# Altium project AltiumSTM32_ExamplePCB.PrjPcb
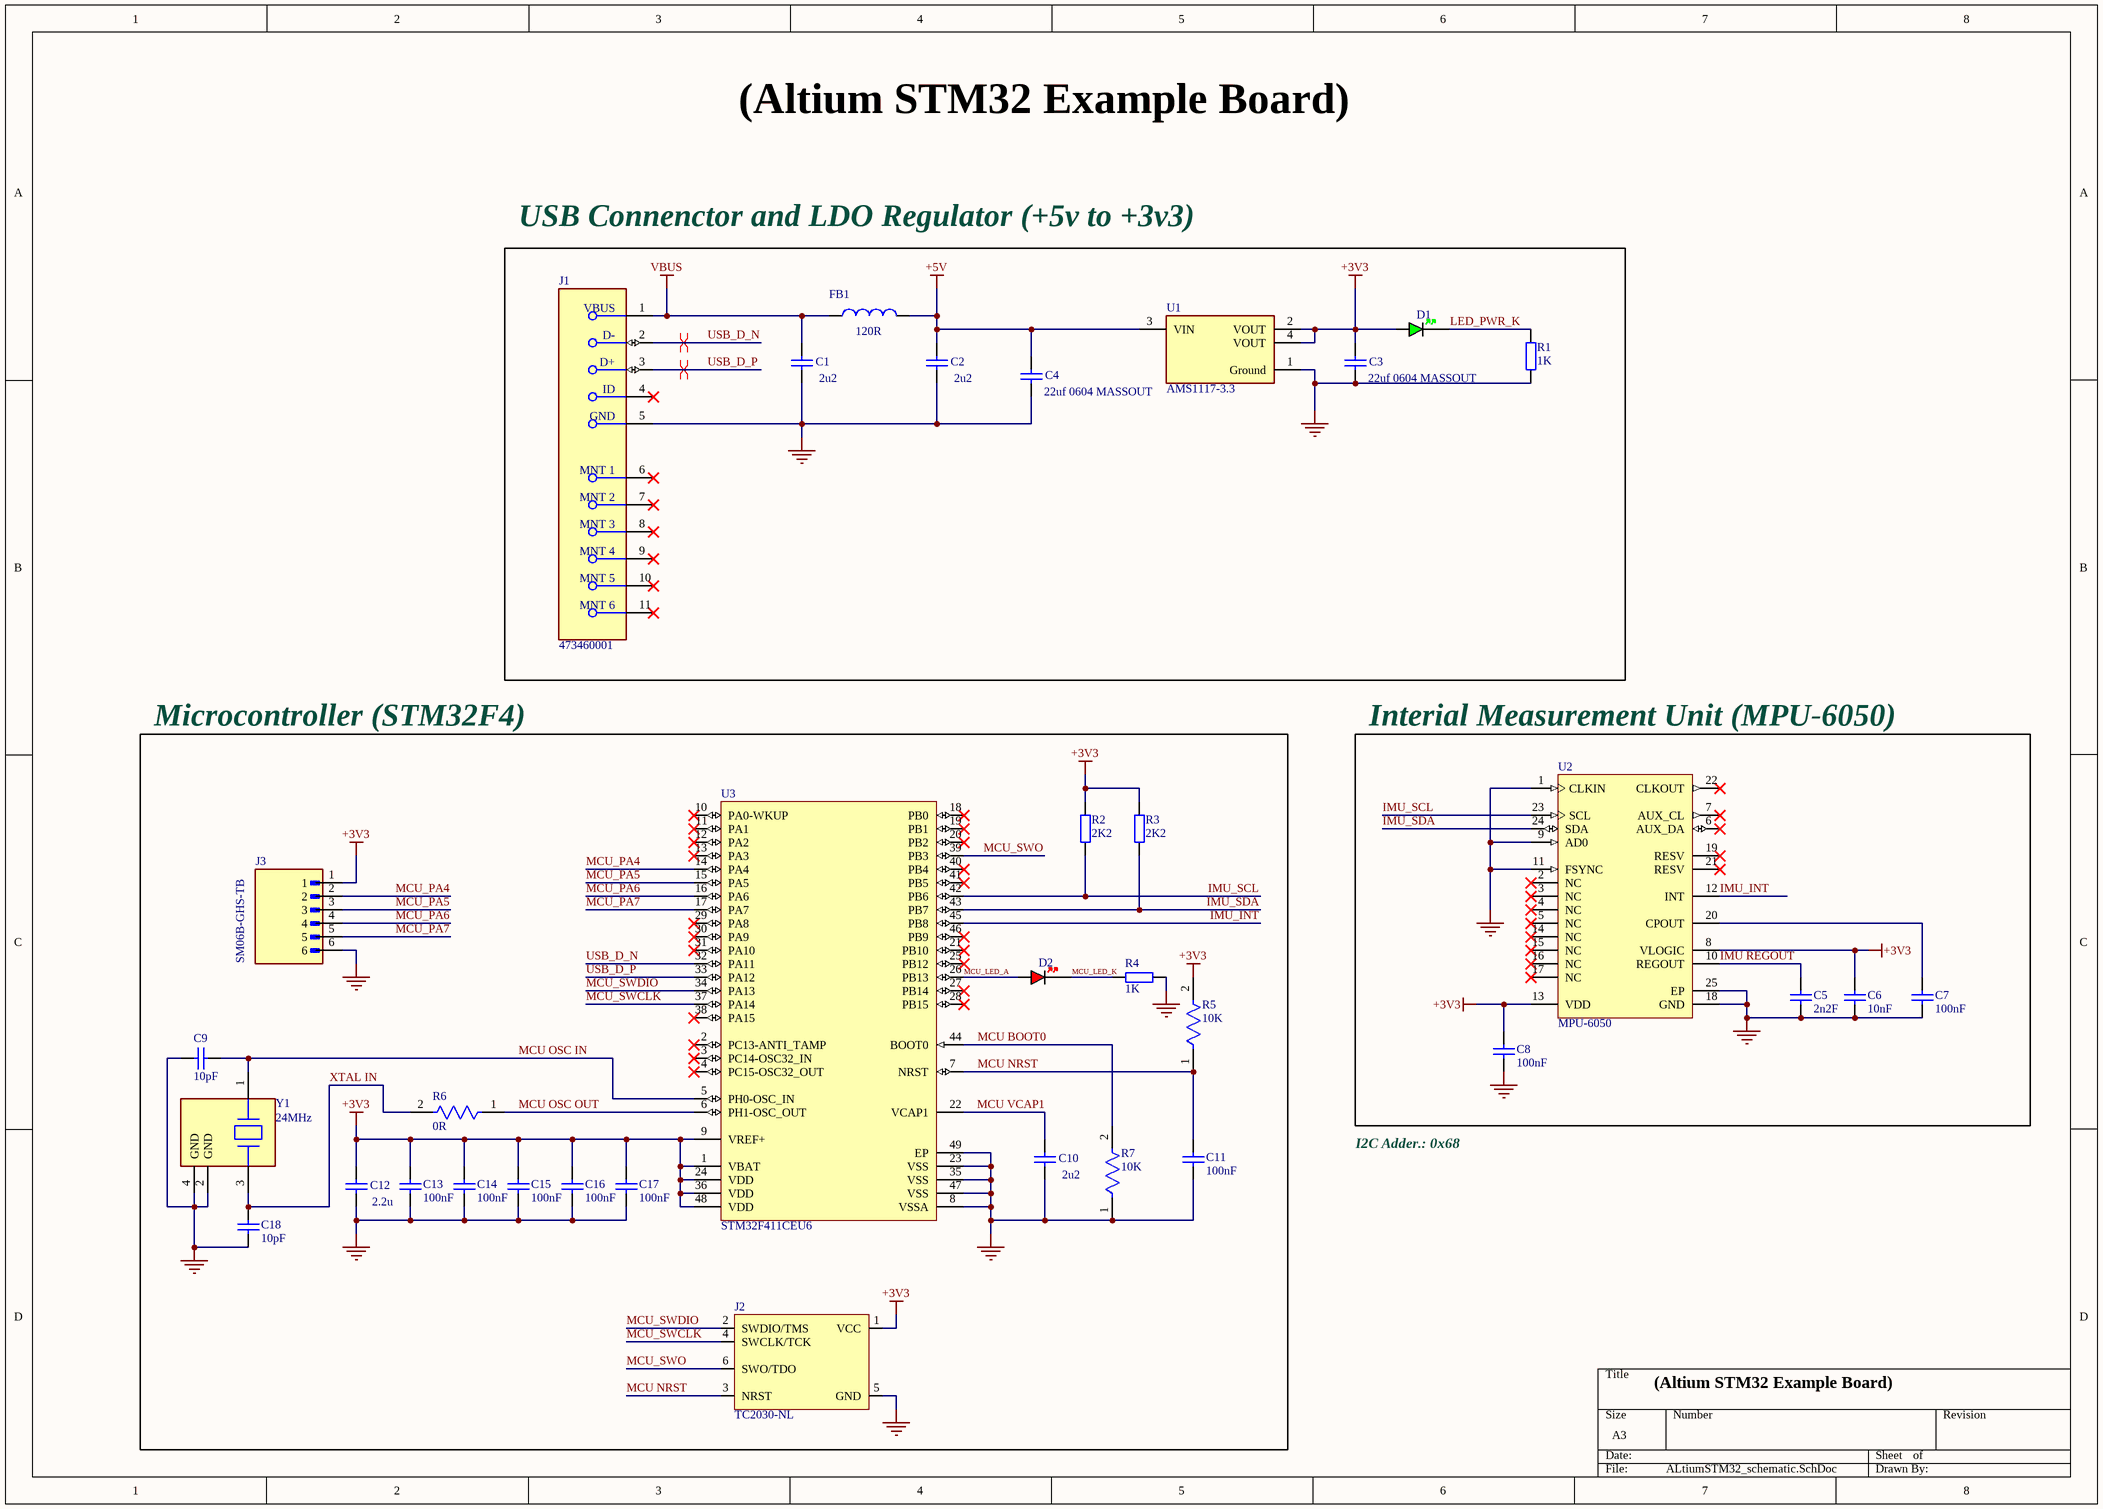
[diagram p0: ALtiumSTM32_schematic.SchDoc]
1 sheet, 35 parts. Net scope: global (net labels, ports and power ports of the same name join across sheets).
Board file: PCB1.PcbDoc

## Sheet ALtiumSTM32_schematic.SchDoc
size A3; SheetNumber: 1; SheetTotal: 1

### Parts
C1  2u2  [WCAP-CSGP_0603_L1.6W0.8H0.8_Reflow]
C2  2u2  [WCAP-CSGP_0603_L1.6W0.8H0.8_Reflow]
C3  22uf 0604 MASSOUT  [WCAP-CSGP_0603_L1.6W0.8H0.8_Reflow]
C4  22uf 0604 MASSOUT  [WCAP-CSGP_0603_L1.6W0.8H0.8_Reflow]
C5  2n2F  [CAPC1005X56X25LL10T15]
C6  10nF  [CAPC1005X56X25LL10T15]
C7  100nF  [CAPC1005X56X25LL10T15]
C8  100nF  [CAPC1005X56X25LL10T15]
C9  10pF  [CAPC1005X56X25LL10T15]
C10  2u2  [WCAP-CSGP_0603_L1.6W0.8H0.8_Reflow]
C11  100nF  [CAPC1005X56X25LL10T15]
C12  2.2u  [WCAP-CSGP_0603_L1.6W0.8H0.8_Reflow]
C13  100nF  [CAPC1005X56X25LL10T15]
C14  100nF  [CAPC1005X56X25LL10T15]
C15  100nF  [CAPC1005X56X25LL10T15]
C16  100nF  [CAPC1005X56X25LL10T15]
C17  100nF  [CAPC1005X56X25LL10T15]
C18  10pF  [CAPC1005X56X25LL10T15]
D1  GREEN  [LED_0402_GREEN]  (value not drawn)
D2  RED  [LED_0402_RED]  (value not drawn)
FB1  120R  [WE-CBF HF_0603_HC]
J1  473460001  [FP-473460001-MFG]
J2  TC2030-NL  [TC2030-NL-FP]  (no BOM)
J3  SM06B-GHS-TB  [JST_SM06B-GHS-TB]
R1  1K  [RES_0402]
R2  2K2  [RES_0402]
R3  2K2  [RES_0402]
R4  1K  [RES_0402]
R5  10K  [FP-AC0402-MFG]
R6  0R  [FP-AC0402-MFG]
R7  10K  [FP-AC0402-MFG]
U1  AMS1117-3.3  [FP-AMS1117-IPC_C]
U2  MPU-6050  [IS-QFN-24_V]
U3  STM32F411CEU6  [STM-UFQFPN48_L]
Y1  24MHz  [FP-ABM10AIG-MFG]

### Blocks framed on the sheet
USB Connenctor and LDO Regulator (+5v to +3v3): C1-C4 D1 FB1 J1 R1 U1
Interial Measurement Unit (MPU-6050): C5-C8 U2

### Nets
+3V3: C3.1 C6.2 C8.2 C12.1 C13.2 C14.2 C15.2 C16.2 C17.2 D1.A J2.1(VCC) J3.1 R2.2 R3.2 R5.2 U1.2(VOUT) U1.4(VOUT) U2.8(VLOGIC) U2.13(VDD) U3.1(VBAT) U3.9(VREF+) U3.24(VDD) U3.36(VDD) U3.48(VDD)
+5V: C2.1 C4.1 FB1.2 U1.3(VIN)
GND: C1.2 C2.2 C3.2 C4.2 C5.1 C6.1 C7.1 C8.1 C9.2 C10.2 C11.1 C12.2 C13.1 C14.1 C15.1 C16.1 C17.1 C18.1 J1.5(GND) J2.5(GND) J3.6 R1.1 R4.1 R7.1 U1.1(Ground) U2.1(CLKIN) U2.9(AD0) U2.11(FSYNC) U2.18(GND) U2.25(EP) U3.8(VSSA) U3.23(VSS) U3.35(VSS) U3.47(VSS) U3.49(EP) Y1.2(GND) Y1.4(GND)
VBUS: C1.1 FB1.1 J1.1(VBUS)
IMU REGOUT: C5.2 U2.10(REGOUT)
IMU_INT: U2.12(INT) U3.45(PB8)
IMU_SCL: R2.1 U2.23(SCL) U3.42(PB6)
IMU_SDA: R3.1 U2.24(SDA) U3.43(PB7)
LED_PWR_K: D1.K R1.2
MCU BOOT0: R7.2 U3.44(BOOT0)
MCU NRST: C11.2 J2.3(NRST) R5.1 U3.7(NRST)
MCU OSC IN: C9.1 U3.5(PH0-OSC_IN) Y1.1(1_Crystal)
MCU OSC OUT: R6.1 U3.6(PH1-OSC_OUT)
MCU VCAP1: C10.1 U3.22(VCAP1)
MCU_LED_A: D2.A U3.26(PB13)
MCU_LED_K: D2.K R4.2
MCU_PA4: J3.2 U3.14(PA4)
MCU_PA5: J3.3 U3.15(PA5)
MCU_PA6: J3.4 U3.16(PA6)
MCU_PA7: J3.5 U3.17(PA7)
MCU_SWCLK: J2.4(SWCLK/TCK) U3.37(PA14)
MCU_SWDIO: J2.2(SWDIO/TMS) U3.34(PA13)
MCU_SWO: J2.6(SWO/TDO) U3.39(PB3)
USB_D_N: J1.2(D-) U3.32(PA11)
USB_D_P: J1.3(D+) U3.33(PA12)
XTAL IN: C18.2 R6.2 Y1.3(2_Crystal)
NetC7_2: C7.2 U2.20(CPOUT)

Not connected (* = marked no-connect by the designer): J1 4(ID)* 6(MNT_1)* 7(MNT_2)* 8(MNT_3)* 9(MNT_4)* 10(MNT_5)* 11(MNT_6)*; U2 2(NC)* 3(NC)* 4(NC)* 5(NC)* 6(AUX_DA)* 7(AUX_CL)* 14(NC)* 15(NC)* 16(NC)* 17(NC)* 19(RESV)* 21(RESV)* 22(CLKOUT)*; U3 2(PC13-ANTI_TAMP)* 3(PC14-OSC32_IN)* 4(PC15-OSC32_OUT)* 10(PA0-WKUP)* 11(PA1)* 12(PA2)* 13(PA3)* 18(PB0)* 19(PB1)* 20(PB2)* 21(PB10)* 25(PB12)* 27(PB14)* 28(PB15)* 29(PA8)* 30(PA9)* 31(PA10)* 38(PA15)* 40(PB4)* 41(PB5)* 46(PB9)*

### Layout directives
differential pair; net class diff_usb: USB_D_N, USB_D_P

### Notes on the sheet
- (Altium STM32 Example Board)
- Microcontroller (STM32F4)
- I2C Adder.: 0x68

### Library data of the parts
C1-C4 C10 C12 = CMP-03913-53914739-2: WCAP-CSGP 0603 (1608Metric) Ceramic Capacitor 0.063Lx0.031W 1.60mmx0.80mm X7R ±10% 220pF; Insulation Resistance: 10GΩ; Voltage Rating: 16V; Length: 1.6mm; Dielectric: X7R; Height: 800µm; Case/Package: 0603; Mount: Surface Mount; Packaging: Tape & Reel (TR); RoHS: Compliant; Case Code (Metric): 1608; Tolerance: 10%; Case Code (Imperial): 0603; Capacitance: 220pF; Min Operating Temperature: -55°C; Thickness: 863.6µm; Voltage Rating (DC): 16V; Width: 800µm; Max Operating Temperature: 125°C
C5-C9 C11 C13-C18 = CMP-2008-02845-1: Part Number: 0402YD223KAT2A; Manufacturer: AVX Interconnect / Elco
D1 = LED_0402_GREEN: LED 0402 GREEN SMD
D2 = LED_0402_RED: LED 0402 RED SMD
FB1 = CMP-0220-00101-3: Ferrite Bead (emi Suppression), 1.6X0.8X0.8MM (0603), 600O Impedance At 100 Mhz; Current Rating: 400mA; DC Resistance (DCR): 220mΩ; Max Current Rating: 500mA; Impedance: 600Ω; Tolerance: 25%; Resistance: 350mΩ; Number of Lines: 1; Test Frequency: 100MHz; Height: 800µm; Min Operating Temperature: -55°C; Length: 1.6mm; Width: 800µm; Case Code (Imperial): 0603; Depth: 800µm; Number of Pins: 2; Case Code (Metric): 1608; Case/Package: SMD/SMT; Lead Free: Lead Free; Core Material: Ferrite; Max Operating Temperature: 125°C; Termination: SMD/SMT; RoHS: Compliant; REACH SVHC: Unknown; Max DC Current: 500mA; Mount: Surface Mount
J1 = CMP-2000-05246-2: CONN RCPT USB2.0 MICRO B SMD R/A; Manufacturer: Molex; Conn Orientation: Right Angle; Is Female: yes; Shielding: true; Pitch: 0.65mm; Number Of Contacts: 5; Voltage Rating: 30V; Current Rating: 1.8A; Device Class L2: USB Connectors; Digikey Description: CONN RCPT USB2.0 MICRO B SMD R/A; Height: 2.945mm; RoHS: TRUE; ComponentLink2Description: Datasheet; Octopart: https://octopart.com/47346-0001-molex-7164928; Automotive: No; Package: 0; Category: Conn; Device Class L1: Connectors; Usb Standard: USB 2.0; Temperature: -30°C to +85°C; Temperature Range Low: -30°C; Footprint Url: https://www.molex.com/pdm_docs/sd/473460001_sd.pdf; ComponentLink2URL: https://www.molex.com/webdocs/datasheets/pdf/en-us/0473460001_IO_CONNECTORS.pdf; Lead Free: Yes; Manufacturer Part Number: 473460001; Contact Material: Gold,Nickel; Temperature Range High: +85°C; Device Class L3: unset
J2 = TC2030-NL: Tag-Connect No-Solder SWD Debug Connector (No Legs) DO NOT PLACE; Manufacturer: Tag-Connect; Manufacturer Part Number: TC2030-NL-FP
J3 = CMP-002-00176-1: Connector Header Surface Mount, Right Angle 6 position 0.049 (1.25mm); MF: JST Sales; Source: SM06B-GHS-TB.SchLib; Component Type: Standard; MP: SM06B-GHS-TB; Check_prices: https://www.snapeda.com/parts/SM06B-GHS-TB/JST/view-part/?ref=eda; SnapEDA_Link: https://www.snapeda.com/parts/SM06B-GHS-TB/JST/view-part/?ref=snap; Pins: 6; Design Item ID: SM06B-GHS-TB; Case/Package: None; Value: *
R1-R4 = RES_0402: Resistor SMD 0402; Manufacturer: *; Manufacturer Part Number: *; Distributor Link: *; LCSC: *
R5-R7 = CMP-03412-025001-2: RES 11.3kΩ ±0.5% 0.063W 0402; RoHS Compliant: Yes
U1 = CMP-209535-000001-1: LDO Voltage Regulators 1A, 3.3V; Manufacturer: Advanced Monolithic Systems; Dropout Voltage: 1.1V; Output Type: Fixed; Nominal Supply Current: 5mA; Max Power Dissipation: 1.2W; Max Supply Voltage: 15V; Number Of Outputs: 1; Standoff Height: 0.64mm; Max Junction Temp: +125°C; Height: 1.8mm; Package: AMS1117; Device Class L2: Power Management ICs; ComponentLink2Description: Datasheet; ComponentLink2URL: http://www.advanced-monolithic.com/pdf/ds1117.pdf; Category: IC; RoHS: TRUE; Automotive: No; Device Class L1: Integrated Circuits (ICs); Output Current: 1A; Device Class L3: Voltage Regulators - Linear; Temperature: -40°C to +125°C; Output Voltage: 3.3V; Manufacturer Part Number: AMS1117-3.3; Temperature Range Low: -40°C; Octopart: https://octopart.com/ams1117-3.3-advanced+monolithic+systems-25899300; Lead Free: Yes; Ipc Land Pattern Name: SOT229P700X180-4; Temperature Range High: +125°C
U2 = CMP-1753-00002-2: 3-Axis Gyroscope, Accelerometer and a Digital Motion Processor(TM) (DMP), 2.375 to 3.46 V, -40 to 85 degC, 24-Pin QFN, RoHS, Tape and Reel; Manufacturer: InvenSense; Featured Product: MPU-60506-Axis,IntegratedI²CSolution; Other Names: 1428-1007-2 / MPU6050; Sensor Type: MotionTracking; Online Catalog: MPU-6000™Series; Unit PriceUSD: Digital; Datasheet Version: Rev. 3.3, 05/2012; Category: Sensors,Transducers; Datasheet URL: http://datasheet.octopart.com/MPU-6050-InvenSense-datasheet-14421344.pdf; Family: Multifunction; Standard Package: 5,000; Manufacturer URL: http://www.invensense.com/; Output Type: Digital; Dynamic Catalog: MPU-6000™Series
U3 = CMP-0243-00165-1: ARM Cortex-M4 32-bit MCU+FPU, 512 KB Flash, 128 KB RAM, 36 I/Os, 48-Pin UFQFPN, -40 to 85 degC, Tray; Operating Frequency(F) (Processor speed) (MHz): 100; FLASH Size (Prog) (kB): 512; Internal RAM Size (kB): 128; I/Os (High Current): 36; Supply Voltage(Vcc) min (V): 1.7; Package Reference: 48-Pin Ultra Thin Fine Pitch Quad Flat No-Lead, 7 x 7 x 0.6 mm Body, 0.5 mm Pitch, Exposed Pad; ComponentLink1Description: Manufacturer URL; ComponentLink1URL: http://www.st.com/; Packing: Tray; Package Description: UFQFPN48; Core: ARM Cortex-M4; ComponentLink2Description: Datasheet; ComponentLink2URL: http://www.st.com/st-web-ui/static/active/en/resource/technical/document/datasheet/DM00115249.pdf; DatasheetVersion: Rev. 6; Mounting Technology: Surface Mount
Y1 = CMP-27762-010727-1: Crystal 24MHz ±30ppm 10pF SMD-4 2.5mm x 2mm Automotive; ESR (Equivalent Series Resistance): 60R; Frequency Stability: 50ppm; Min Operating Temperature: -40°C; Frequency: 24MHz; Frequency Tolerance: 30ppm; Packaging: Tape and Reel; Ratings: AEC-Q200; Length: 0.098inch; RoHS Compliant: Yes; Case/Package: SMD/SMT; Load Capacitance: 10pF; Width: 0.079inch; Height: 0.024inch; Mount: Surface Mount; Max Operating Temperature: 105°C